# Altium schematic sheet Ticketing_Master.SchDoc
size A4; Author: Mario Dos Santos; Organization: ETML-ES; Address1: Avenue Recordon 1; Address2: 1004 Lausanne; Address3: Switzerland; SheetNumber: 1; SheetTotal: 6
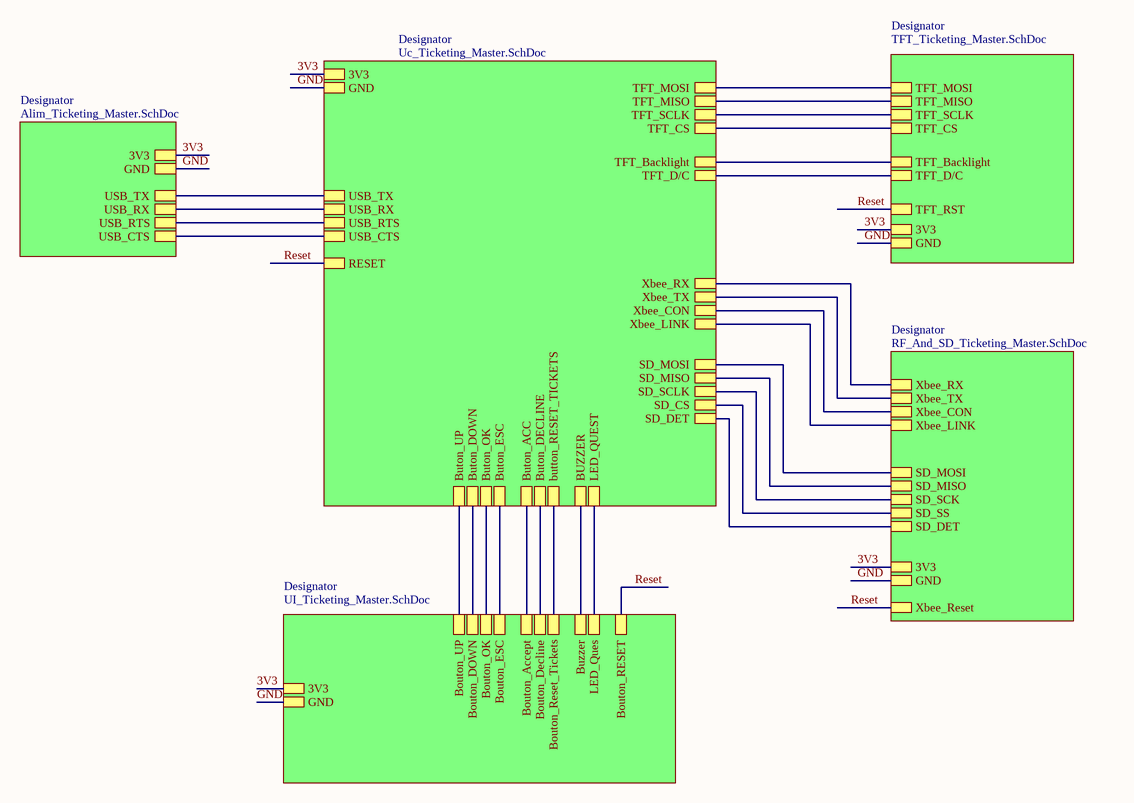
[diagram p0: Ticketing_Master.SchDoc]

## Sub-sheets
Designator = Alim_Ticketing_Master.SchDoc: 3V3, GND, USB_TX, USB_RX, USB_RTS, USB_CTS
Designator = RF_And_SD_Ticketing_Master.SchDoc: Xbee_RX, Xbee_TX, SD_MISO, Xbee_Reset, SD_SS, SD_MOSI, SD_SCK, Xbee_CON, Xbee_LINK, GND, 3V3, SD_DET
Designator = TFT_Ticketing_Master.SchDoc: TFT_MOSI, TFT_Backlight, TFT_CS, TFT_RST, TFT_D/C, TFT_MISO, TFT_SCLK, 3V3, GND
Designator = Uc_Ticketing_Master.SchDoc: 3V3, GND, SD_SCLK, TFT_SCLK, SD_MOSI, SD_MISO, Xbee_RX, Xbee_TX, TFT_MOSI, TFT_MISO, TFT_Backlight, SD_CS, TFT_CS, TFT_D/C, Xbee_CON, Xbee_LINK, Buton_UP, Buton_OK, Buton_ESC, Buton_DOWN, LED_QUEST, BUZZER, Buton_DECLINE, button_RESET_TICKETS, Buton_ACC, RESET, SD_DET, USB_TX, USB_RX, USB_RTS, USB_CTS
Designator = UI_Ticketing_Master.SchDoc: GND, 3V3, Buzzer, Bouton_Accept, Bouton_UP, Bouton_OK, LED_Ques, Bouton_ESC, Bouton_Decline, Bouton_Reset_Tickets, Bouton_DOWN, Bouton_RESET

## Nets
3V3: sheet Designator/3V3, sheet Designator/3V3, sheet Designator/3V3, sheet Designator/3V3, sheet Designator/3V3
GND: sheet Designator/GND, sheet Designator/GND, sheet Designator/GND, sheet Designator/GND, sheet Designator/GND
Reset: sheet Designator/Xbee_Reset, sheet Designator/TFT_RST, sheet Designator/RESET, sheet Designator/Bouton_RESET
(unnamed): sheet Designator/USB_TX, sheet Designator/USB_TX
(unnamed): sheet Designator/USB_RX, sheet Designator/USB_RX
(unnamed): sheet Designator/USB_RTS, sheet Designator/USB_RTS
(unnamed): sheet Designator/USB_CTS, sheet Designator/USB_CTS
(unnamed): sheet Designator/Xbee_RX, sheet Designator/Xbee_RX
(unnamed): sheet Designator/Xbee_TX, sheet Designator/Xbee_TX
(unnamed): sheet Designator/SD_MISO, sheet Designator/SD_MISO
(unnamed): sheet Designator/SD_SS, sheet Designator/SD_CS
(unnamed): sheet Designator/SD_MOSI, sheet Designator/SD_MOSI
(unnamed): sheet Designator/SD_SCK, sheet Designator/SD_SCLK
(unnamed): sheet Designator/Xbee_CON, sheet Designator/Xbee_CON
(unnamed): sheet Designator/Xbee_LINK, sheet Designator/Xbee_LINK
(unnamed): sheet Designator/SD_DET, sheet Designator/SD_DET
(unnamed): sheet Designator/TFT_MOSI, sheet Designator/TFT_MOSI
(unnamed): sheet Designator/TFT_Backlight, sheet Designator/TFT_Backlight
(unnamed): sheet Designator/TFT_CS, sheet Designator/TFT_CS
(unnamed): sheet Designator/TFT_D/C, sheet Designator/TFT_D/C
(unnamed): sheet Designator/TFT_MISO, sheet Designator/TFT_MISO
(unnamed): sheet Designator/TFT_SCLK, sheet Designator/TFT_SCLK
(unnamed): sheet Designator/Buton_UP, sheet Designator/Bouton_UP
(unnamed): sheet Designator/Buton_OK, sheet Designator/Bouton_OK
(unnamed): sheet Designator/Buton_ESC, sheet Designator/Bouton_ESC
(unnamed): sheet Designator/Buton_DOWN, sheet Designator/Bouton_DOWN
(unnamed): sheet Designator/LED_QUEST, sheet Designator/LED_Ques
(unnamed): sheet Designator/BUZZER, sheet Designator/Buzzer
(unnamed): sheet Designator/Buton_DECLINE, sheet Designator/Bouton_Decline
(unnamed): sheet Designator/button_RESET_TICKETS, sheet Designator/Bouton_Reset_Tickets
(unnamed): sheet Designator/Buton_ACC, sheet Designator/Bouton_Accept

## Notes on the sheet
- Fichier :
- a
- Date :
- Heure :
- Version :
- Auteur :
- Modif.
- b
- c
- d
- Projet :
- No :
- Nb feuilles
- Feuille n°
- Chemin :